# Altium schematic sheet LED_RING_12V_00.SchDoc: LED RING 12V
size A3; Date: 21/03/2017; DrawnBy: Wim Van Gool; Revision: 00; SheetNumber: 1; SheetTotal: 1
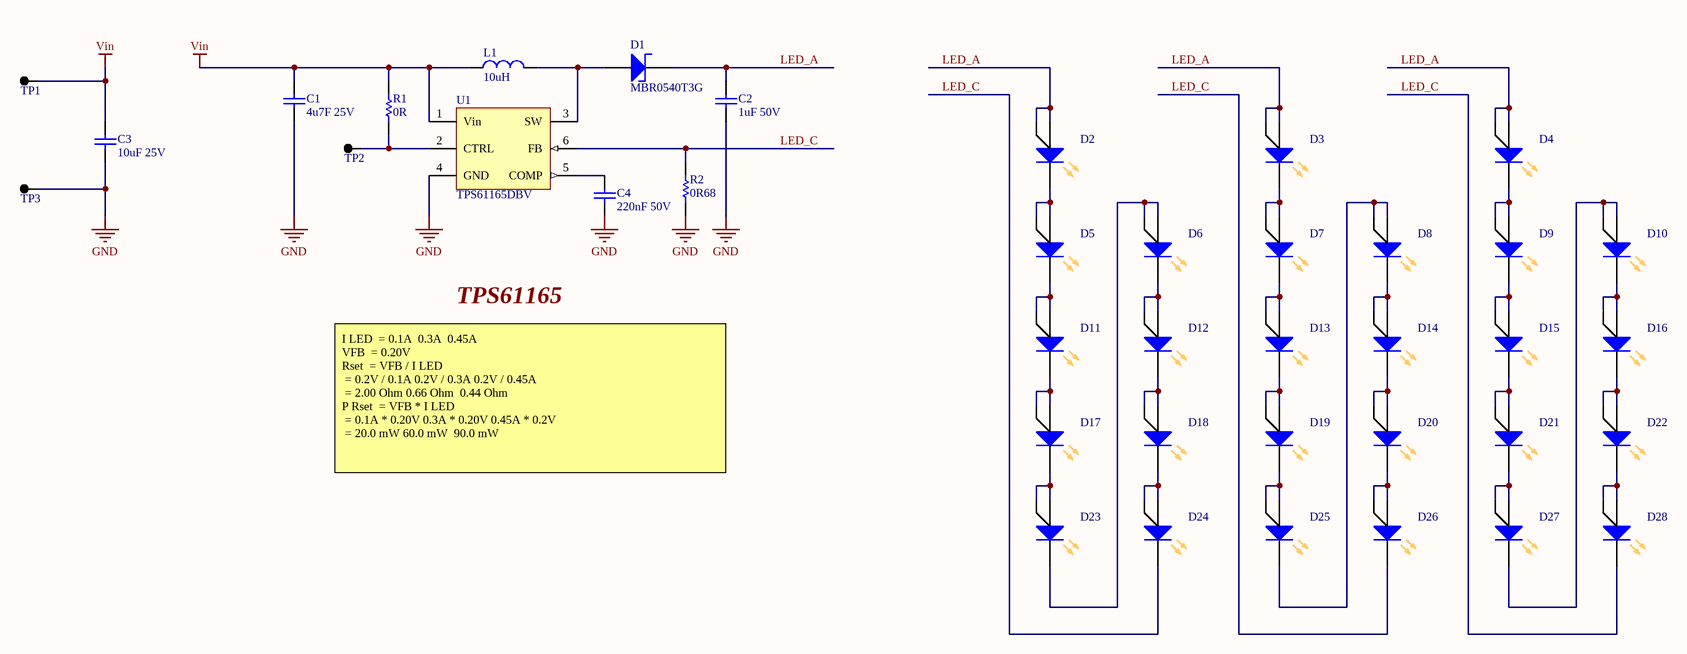
[diagram p0: LED_RING_12V_00.SchDoc]

## Parts
C1  value 4u7F 25V  [C0805_N]  (hidden comment: CAP_CERAMIC)
C2  value 1uF 50V  [C0805_N]  (hidden comment: CAP_CERAMIC)
C3  value 10uF 25V  [C1206_N]  (hidden comment: CAP_CERAMIC)
C4  value 220nF 50V  [C0603_N]  (hidden comment: CAP_CERAMIC)
D1  value MBR0540T3G  [ON_SOD-123FL]  (hidden comment: MBR0540T3G Schottky ULTRAFAST, 500MA, 40V)
D2  5630 5630AZLxx Lite ON LED  [LED_LM561A]  (value not drawn)
D3  5630 5630AZLxx Lite ON LED  [LED_LM561A]  (value not drawn)
D4  5630 5630AZLxx Lite ON LED  [LED_LM561A]  (value not drawn)
D5  5630 5630AZLxx Lite ON LED  [LED_LM561A]  (value not drawn)
D6  5630 5630AZLxx Lite ON LED  [LED_LM561A]  (value not drawn)
D7  5630 5630AZLxx Lite ON LED  [LED_LM561A]  (value not drawn)
D8  5630 5630AZLxx Lite ON LED  [LED_LM561A]  (value not drawn)
D9  5630 5630AZLxx Lite ON LED  [LED_LM561A]  (value not drawn)
D10  5630 5630AZLxx Lite ON LED  [LED_LM561A]  (value not drawn)
D11  5630 5630AZLxx Lite ON LED  [LED_LM561A]  (value not drawn)
D12  5630 5630AZLxx Lite ON LED  [LED_LM561A]  (value not drawn)
D13  5630 5630AZLxx Lite ON LED  [LED_LM561A]  (value not drawn)
D14  5630 5630AZLxx Lite ON LED  [LED_LM561A]  (value not drawn)
D15  5630 5630AZLxx Lite ON LED  [LED_LM561A]  (value not drawn)
D16  5630 5630AZLxx Lite ON LED  [LED_LM561A]  (value not drawn)
D17  5630 5630AZLxx Lite ON LED  [LED_LM561A]  (value not drawn)
D18  5630 5630AZLxx Lite ON LED  [LED_LM561A]  (value not drawn)
D19  5630 5630AZLxx Lite ON LED  [LED_LM561A]  (value not drawn)
D20  5630 5630AZLxx Lite ON LED  [LED_LM561A]  (value not drawn)
D21  5630 5630AZLxx Lite ON LED  [LED_LM561A]  (value not drawn)
D22  5630 5630AZLxx Lite ON LED  [LED_LM561A]  (value not drawn)
D23  5630 5630AZLxx Lite ON LED  [LED_LM561A]  (value not drawn)
D24  5630 5630AZLxx Lite ON LED  [LED_LM561A]  (value not drawn)
D25  5630 5630AZLxx Lite ON LED  [LED_LM561A]  (value not drawn)
D26  5630 5630AZLxx Lite ON LED  [LED_LM561A]  (value not drawn)
D27  5630 5630AZLxx Lite ON LED  [LED_LM561A]  (value not drawn)
D28  5630 5630AZLxx Lite ON LED  [LED_LM561A]  (value not drawn)
L1  value 10uH  [LAIRD_TYS5020]  (hidden comment: TYS5020100M-10)
R1  value 0R  [R0603_N]  (hidden comment: RESISTOR)
R2  value 0R68  [R1206]  (hidden comment: RESISTOR)
TP1  TEST_PAD  [TP_2x3mm]  (value not drawn)
TP2  TEST_PAD  [TP_2x3mm]  (value not drawn)
TP3  TEST_PAD  [TP_2x3mm]  (value not drawn)
U1  value TPS61165DBV  [TI_DBV_R-PDSO-G6]  (hidden comment: TPS61165 38-V Boost WLED Driver with PWM)

## Nets
GND: C1.2 C2.2 C3.2 C4.2 R2.2 TP3.1 U1.4(GND)
Vin: C1.1 C3.1 L1.1 R1.1 TP1.1 U1.1(Vin)
LED_A: C2.1 D1.1(C) D2.2(K) D2.3(K) D3.2(K) D3.3(K) D4.2(K) D4.3(K)
LED_C: D24.1(A) D26.1(A) D28.1(A) R2.1 U1.6(FB)
NetC4_1: C4.1 U1.5(COMP)
NetD1_2: D1.2(A) L1.2 U1.3(SW)
NetD2_1: D2.1(A) D5.2(K) D5.3(K)
NetD3_1: D3.1(A) D7.2(K) D7.3(K)
NetD4_1: D4.1(A) D9.2(K) D9.3(K)
NetD5_1: D5.1(A) D11.2(K) D11.3(K)
NetD6_1: D6.1(A) D12.2(K) D12.3(K)
NetD6_2: D6.2(K) D6.3(K) D23.1(A)
NetD7_1: D7.1(A) D13.2(K) D13.3(K)
NetD8_1: D8.1(A) D14.2(K) D14.3(K)
NetD8_2: D8.2(K) D8.3(K) D25.1(A)
NetD9_1: D9.1(A) D15.2(K) D15.3(K)
NetD10_1: D10.1(A) D16.2(K) D16.3(K)
NetD10_2: D10.2(K) D10.3(K) D27.1(A)
NetD11_1: D11.1(A) D17.2(K) D17.3(K)
NetD12_1: D12.1(A) D18.2(K) D18.3(K)
NetD13_1: D13.1(A) D19.2(K) D19.3(K)
NetD14_1: D14.1(A) D20.2(K) D20.3(K)
NetD15_1: D15.1(A) D21.2(K) D21.3(K)
NetD16_1: D16.1(A) D22.2(K) D22.3(K)
NetD17_1: D17.1(A) D23.2(K) D23.3(K)
NetD18_1: D18.1(A) D24.2(K) D24.3(K)
NetD19_1: D19.1(A) D25.2(K) D25.3(K)
NetD20_1: D20.1(A) D26.2(K) D26.3(K)
NetD21_1: D21.1(A) D27.2(K) D27.3(K)
NetD22_1: D22.1(A) D28.2(K) D28.3(K)
NetR1_2: R1.2 TP2.1 U1.2(CTRL)

## Notes on the sheet
- TPS61165
- I LED 	= 0.1A		0.3A		0.45A
  VFB 	= 0.20V
  Rset 	= VFB / I LED
  = 0.2V / 0.1A	0.2V / 0.3A	0.2V / 0.45A
  = 2.00 Ohm	0.66 Ohm		0.44 Ohm
  P Rset 	= VFB * I LED
  = 0.1A * 0.20V	0.3A * 0.20V	0.45A * 0.2V
  = 20.0 mW	60.0 mW		90.0 mW
- Title
- Revision
- Date
- Dranw By
- Size
- A3
- Sheet
- of

## Library data of the parts
C1 = CAP # 4u7F 25V 0805: Capacitor Ceramic; Supplier 1: Farnell; Supplier Part Number 1: 2362111
C2 = CAP # 1uF 50V 0805: Capacitor Ceramic; Supplier 1: Farnell; Supplier Part Number 1: 1845750
C3 = CAP # 10uF 25V 1206: Capacitor Ceramic; Supplier 1: Farnell; Supplier Part Number 1: 2320887
C4 = CAP # 220nF 50V 0603: Capacitor Ceramic; Supplier 1: Farnell; Supplier Part Number 1: 2346906
D1 = Schottky # MBR0540T3G: =Description; Supplier 1: Farnell; Supplier Part Number 1: 2101839
D2-D28 = LED # LiteOn LTW-5630AZL27: =Description; Description: LED # LiteOn LTW-5630AZL27; Value: LTW-5630AZL27; Supplier 1: Digikey; Supplier Part Number 1: 160-2091-1-ND
L1 = IND # 10uH TYS5020100M-10: Supplier 1: Farnell; Supplier Part Number 1: 2292527
R1 = RES # 0R 0603: Supplier 1: Farnell; Supplier Part Number 1: 2447743
R2 = RES # 0R68 1206: Supplier 1: Farnell; Supplier Part Number 1: 2008307
TP1-TP3 = TP # 2x3mm: Value: NO BOM
U1 = LED_DRVR # TPS61165: =Description; Supplier 1: Farnell; Supplier Part Number 1: 2323441